# EAGLE design cannon (EAGLE 9.3.2)
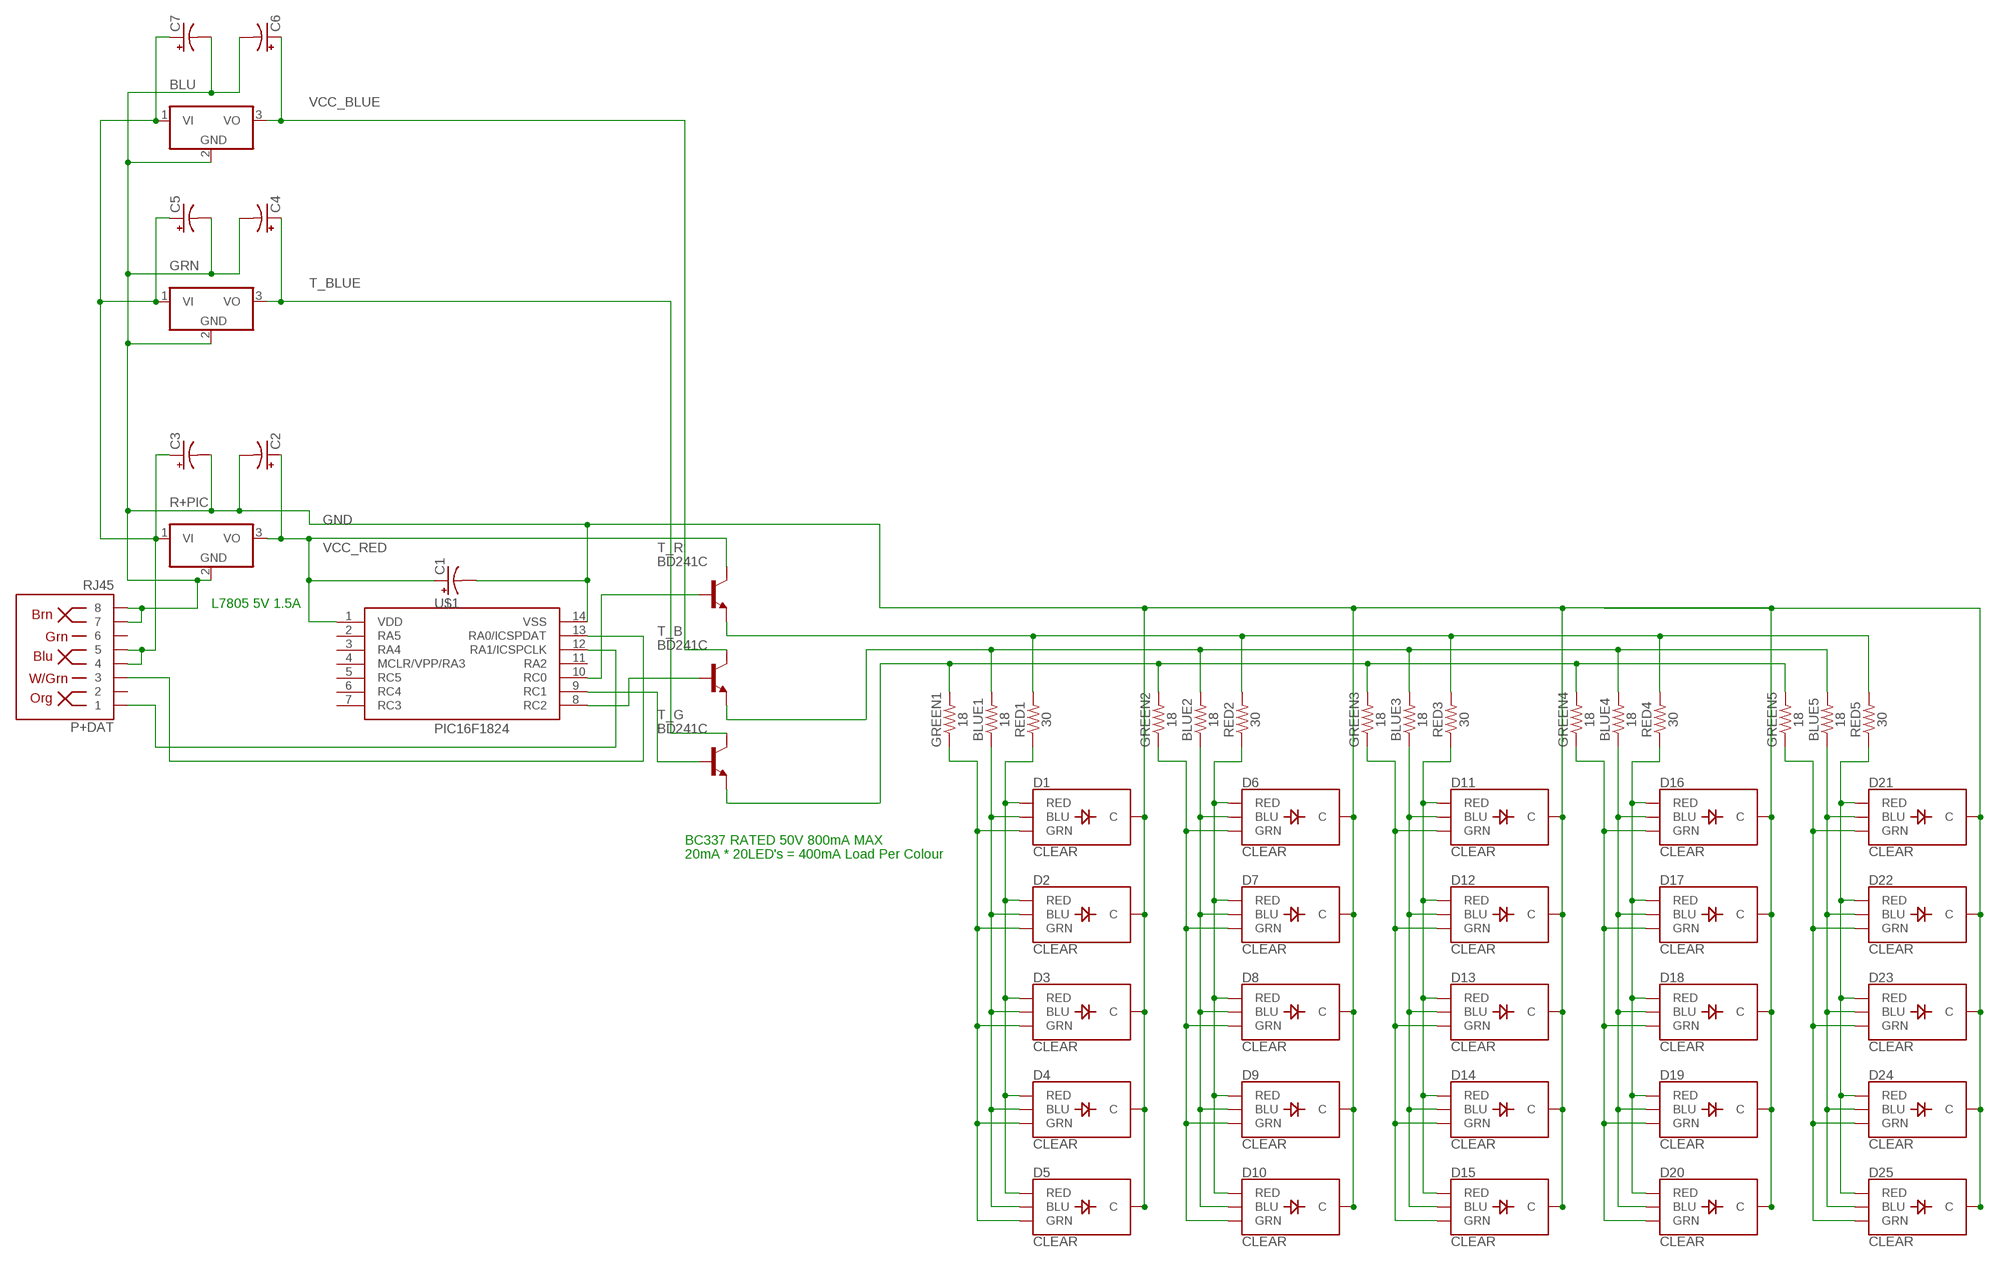
[diagram p0: schematic, sheet 1]

## Parts
BLU  7805TV  [TO220V]
BLUE1  18  10OHM-HORIZ-1/4W-1%  [AXIAL-0.3]
BLUE2  18  10OHM-HORIZ-1/4W-1%  [AXIAL-0.3]
BLUE3  18  10OHM-HORIZ-1/4W-1%  [AXIAL-0.3]
BLUE4  18  10OHM-HORIZ-1/4W-1%  [AXIAL-0.3]
BLUE5  18  10OHM-HORIZ-1/4W-1%  [AXIAL-0.3]
C1  0.1uF  CAPACITOR-PE2.5-6  [E2,5-6]
C2  0.1uF  CAPACITOR-PE2.5-6  [E2,5-6]
C3  0.33uF  CAPACITOR-PE2.5-6  [E2,5-6]
C4  0.1uF  CAPACITOR-PE2.5-6  [E2,5-6]
C5  0.33uF  CAPACITOR-PE2.5-6  [E2,5-6]
C6  0.1uF  CAPACITOR-PE2.5-6  [E2,5-6]
C7  0.33uF  CAPACITOR-PE2.5-6  [E2,5-6]
D1  CLEAR  LED-RGB-CCCLEAR  [LED-RGB-THRU]
D2  CLEAR  LED-RGB-CCCLEAR  [LED-RGB-THRU]
D3  CLEAR  LED-RGB-CCCLEAR  [LED-RGB-THRU]
D4  CLEAR  LED-RGB-CCCLEAR  [LED-RGB-THRU]
D5  CLEAR  LED-RGB-CCCLEAR  [LED-RGB-THRU]
D6  CLEAR  LED-RGB-CCCLEAR  [LED-RGB-THRU]
D7  CLEAR  LED-RGB-CCCLEAR  [LED-RGB-THRU]
D8  CLEAR  LED-RGB-CCCLEAR  [LED-RGB-THRU]
D9  CLEAR  LED-RGB-CCCLEAR  [LED-RGB-THRU]
D10  CLEAR  LED-RGB-CCCLEAR  [LED-RGB-THRU]
D11  CLEAR  LED-RGB-CCCLEAR  [LED-RGB-THRU]
D12  CLEAR  LED-RGB-CCCLEAR  [LED-RGB-THRU]
D13  CLEAR  LED-RGB-CCCLEAR  [LED-RGB-THRU]
D14  CLEAR  LED-RGB-CCCLEAR  [LED-RGB-THRU]
D15  CLEAR  LED-RGB-CCCLEAR  [LED-RGB-THRU]
D16  CLEAR  LED-RGB-CCCLEAR  [LED-RGB-THRU]
D17  CLEAR  LED-RGB-CCCLEAR  [LED-RGB-THRU]
D18  CLEAR  LED-RGB-CCCLEAR  [LED-RGB-THRU]
D19  CLEAR  LED-RGB-CCCLEAR  [LED-RGB-THRU]
D20  CLEAR  LED-RGB-CCCLEAR  [LED-RGB-THRU]
D21  CLEAR  LED-RGB-CCCLEAR  [LED-RGB-THRU]
D22  CLEAR  LED-RGB-CCCLEAR  [LED-RGB-THRU]
D23  CLEAR  LED-RGB-CCCLEAR  [LED-RGB-THRU]
D24  CLEAR  LED-RGB-CCCLEAR  [LED-RGB-THRU]
D25  CLEAR  LED-RGB-CCCLEAR  [LED-RGB-THRU]
GREEN1  18  10OHM-HORIZ-1/4W-1%  [AXIAL-0.3]
GREEN2  18  10OHM-HORIZ-1/4W-1%  [AXIAL-0.3]
GREEN3  18  10OHM-HORIZ-1/4W-1%  [AXIAL-0.3]
GREEN4  18  10OHM-HORIZ-1/4W-1%  [AXIAL-0.3]
GREEN5  18  10OHM-HORIZ-1/4W-1%  [AXIAL-0.3]
GRN  7805TV  [TO220V]
P+DAT  RJ45  RJ45-8  [RJ45-8]
R+PIC  7805TV  [TO220V]
RED1  30  10OHM-HORIZ-1/4W-1%  [AXIAL-0.3]
RED2  30  10OHM-HORIZ-1/4W-1%  [AXIAL-0.3]
RED3  30  10OHM-HORIZ-1/4W-1%  [AXIAL-0.3]
RED4  30  10OHM-HORIZ-1/4W-1%  [AXIAL-0.3]
RED5  30  10OHM-HORIZ-1/4W-1%  [AXIAL-0.3]
T_B  BD241C  2SC1306  [TO220BV]
T_G  BD241C  2SC1306  [TO220BV]
T_R  BD241C  2SC1306  [TO220BV]
U$1  PIC16F1824  [DIP787W45P254L1905H533Q14B]

## Nets
GND: BLU.2(GND) C1.- C2.- C3.- C4.- C5.- C6.- C7.- D1.2(C) D2.2(C) D3.2(C) D4.2(C) D5.2(C) D6.2(C) D7.2(C) D8.2(C) D9.2(C) D10.2(C) D11.2(C) D12.2(C) D13.2(C) D14.2(C) D15.2(C) D16.2(C) D17.2(C) D18.2(C) D19.2(C) D20.2(C) D21.2(C) D22.2(C) D23.2(C) D24.2(C) D25.2(C) GRN.2(GND) P+DAT.7 P+DAT.8 R+PIC.2(GND) U$1.14(VSS)
N$1: P+DAT.1 U$1.12(RA1/ICSPCLK)
N$2: P+DAT.3 U$1.13(RA0/ICSPDAT)
N$4: RED1.P$2 RED2.P$2 RED3.P$2 RED4.P$2 RED5.P$2 T_R.3(E)
N$5: T_R.1(B) U$1.10(RC0)
N$6: T_G.1(B) U$1.9(RC1)
N$7: T_B.1(B) U$1.8(RC2)
N$9: D1.1(RED) D2.1(RED) D3.1(RED) D4.1(RED) D5.1(RED) RED1.P$1
N$10: BLUE2.P$1 D6.4(BLU) D7.4(BLU) D8.4(BLU) D9.4(BLU) D10.4(BLU)
N$11: D6.1(RED) D7.1(RED) D8.1(RED) D9.1(RED) D10.1(RED) RED2.P$1
N$12: D6.3(GRN) D7.3(GRN) D8.3(GRN) D9.3(GRN) D10.3(GRN) GREEN2.P$1
N$13: BLUE1.P$1 D1.4(BLU) D2.4(BLU) D3.4(BLU) D4.4(BLU) D5.4(BLU)
N$14: D1.3(GRN) D2.3(GRN) D3.3(GRN) D4.3(GRN) D5.3(GRN) GREEN1.P$1
N$15: D11.3(GRN) D12.3(GRN) D13.3(GRN) D14.3(GRN) D15.3(GRN) GREEN3.P$1
N$16: BLUE3.P$1 D11.4(BLU) D12.4(BLU) D13.4(BLU) D14.4(BLU) D15.4(BLU)
N$17: BLUE1.P$2 BLUE2.P$2 BLUE3.P$2 BLUE4.P$2 BLUE5.P$2 T_B.3(E)
N$18: D11.1(RED) D12.1(RED) D13.1(RED) D14.1(RED) D15.1(RED) RED3.P$1
N$19: D16.3(GRN) D17.3(GRN) D18.3(GRN) D19.3(GRN) D20.3(GRN) GREEN4.P$1
N$20: BLUE4.P$1 D16.4(BLU) D17.4(BLU) D18.4(BLU) D19.4(BLU) D20.4(BLU)
N$21: D16.1(RED) D17.1(RED) D18.1(RED) D19.1(RED) D20.1(RED) RED4.P$1
N$22: GREEN1.P$2 GREEN2.P$2 GREEN3.P$2 GREEN4.P$2 GREEN5.P$2 T_G.3(E)
N$25: BLU.1(VI) C3.+ C5.+ C7.+ GRN.1(VI) P+DAT.4 P+DAT.5 R+PIC.1(VI)
N$26: D21.3(GRN) D22.3(GRN) D23.3(GRN) D24.3(GRN) D25.3(GRN) GREEN5.P$1
N$27: BLUE5.P$1 D21.4(BLU) D22.4(BLU) D23.4(BLU) D24.4(BLU) D25.4(BLU)
N$28: D21.1(RED) D22.1(RED) D23.1(RED) D24.1(RED) D25.1(RED) RED5.P$1
T_BLUE: C4.+ GRN.3(VO) T_G.2(C)
VCC_BLUE: BLU.3(VO) C6.+ T_B.2(C)
VCC_RED: C1.+ C2.+ R+PIC.3(VO) T_R.2(C) U$1.1(VDD)
Unconnected: P+DAT.2 P+DAT.6 U$1.2(RA5) U$1.3(RA4) U$1.4(MCLR/VPP/RA3) U$1.5(RC5) U$1.6(RC4) U$1.7(RC3) U$1.11(RA2)

## Notes on the sheet
- L7805 5V 1.5A
- BC337 RATED 50V 800mA MAX
- 20mA * 20LED's = 400mA Load Per Colour

## Library data of the parts
BLU GRN R+PIC = linear:78*: Positive VOLTAGE REGULATOR Source: http://cache.national.com/ds/LM/LM78L05.pdf http://www.fairchildsemi.com/ds/LM/LM7805.pdf
BLUE1-BLUE5 GREEN1-GREEN5 RED1-RED5 = SparkFun-Resistors:10OHM: 10Ω resistor A resistor is a passive two-terminal electrical component that implements electrical resistance as a circuit element. Resistors act to reduce current flow, and, at the same time, act to lower voltage levels within circuits. - Wikipedia; PROD_ID: RES-12180; VALUE: 10
C1-C7 = BeagleBone_Blue_R3:CAPACITOR-P: POLARIZED CAPACITOR, American symbol
D1 = SparkFun-LED_MOD:LED-RGB-CC: LED-RGB Common Cathode Packages: LED RGB-THRU LED_PIRANHA_5MM SparkFun Products: RGB Diffused Common Cathode- Diffuse <[https://www.sparkfun.com/products/9264]> RGB Diffused Common Cathode - Clear <[https://www.sparkfun.com/products/105]> LED-RGB 5mm Square (Piranha) <[https://www.sparkfun.com/products/11679]>; PROD_ID: DIO-08418; SPICEPREFIX: E
D2-D25 = SparkFun-LED_MOD:LED-RGB-CC: LED-RGB Common Cathode Packages: LED RGB-THRU LED_PIRANHA_5MM SparkFun Products: RGB Diffused Common Cathode- Diffuse <[https://www.sparkfun.com/products/9264]> RGB Diffused Common Cathode - Clear <[https://www.sparkfun.com/products/105]> LED-RGB 5mm Square (Piranha) <[https://www.sparkfun.com/products/11679]>; PROD_ID: DIO-08418
P+DAT = SparkFun-Connectors:RJ45-8: RJ45 Jack - 8 pin Simple RJ45, 8-pin connection. Commonly used for Cat5, Cat5e, and Cat6 Ethernet cables. Here is the connector we sell at SparkFun: RJ45 8-Pin Connector <https://www.sparkfun.com/products/643> (PRT-00643) Datasheet <https://cdn.sparkfun.com/datasheets/Prototyping/04908.pdf> It is used on this SparkFun product: SparkFun RJ45 Breakout <https://www.sparkfun.com/products/716> (BOB-00716) Note, you may also be interested in the "MAGJACK" version of this. It is basically a RJ45 connector, but also has some status LEDs built into the connector housing. You can check that out in this library at the device named "MAGJACK.dev" and see these products online: RJ45 Ethernet MagJack-Compatible <https://www.sparkfun.com/products/8534> (PRT-08534) SparkFun RJ45 MagJack Breakout <https://www.sparkfun.com/products/13021> (BOB-13021); PROD_ID: CONN-08506; SF_ID: PRT-00643
T_B T_G T_R = transistor:2SC1306: NPN Transistor Final RF Power Outupt Source: 2sc1306.pdf
U$1 = pic:PIC16F1824

## Board
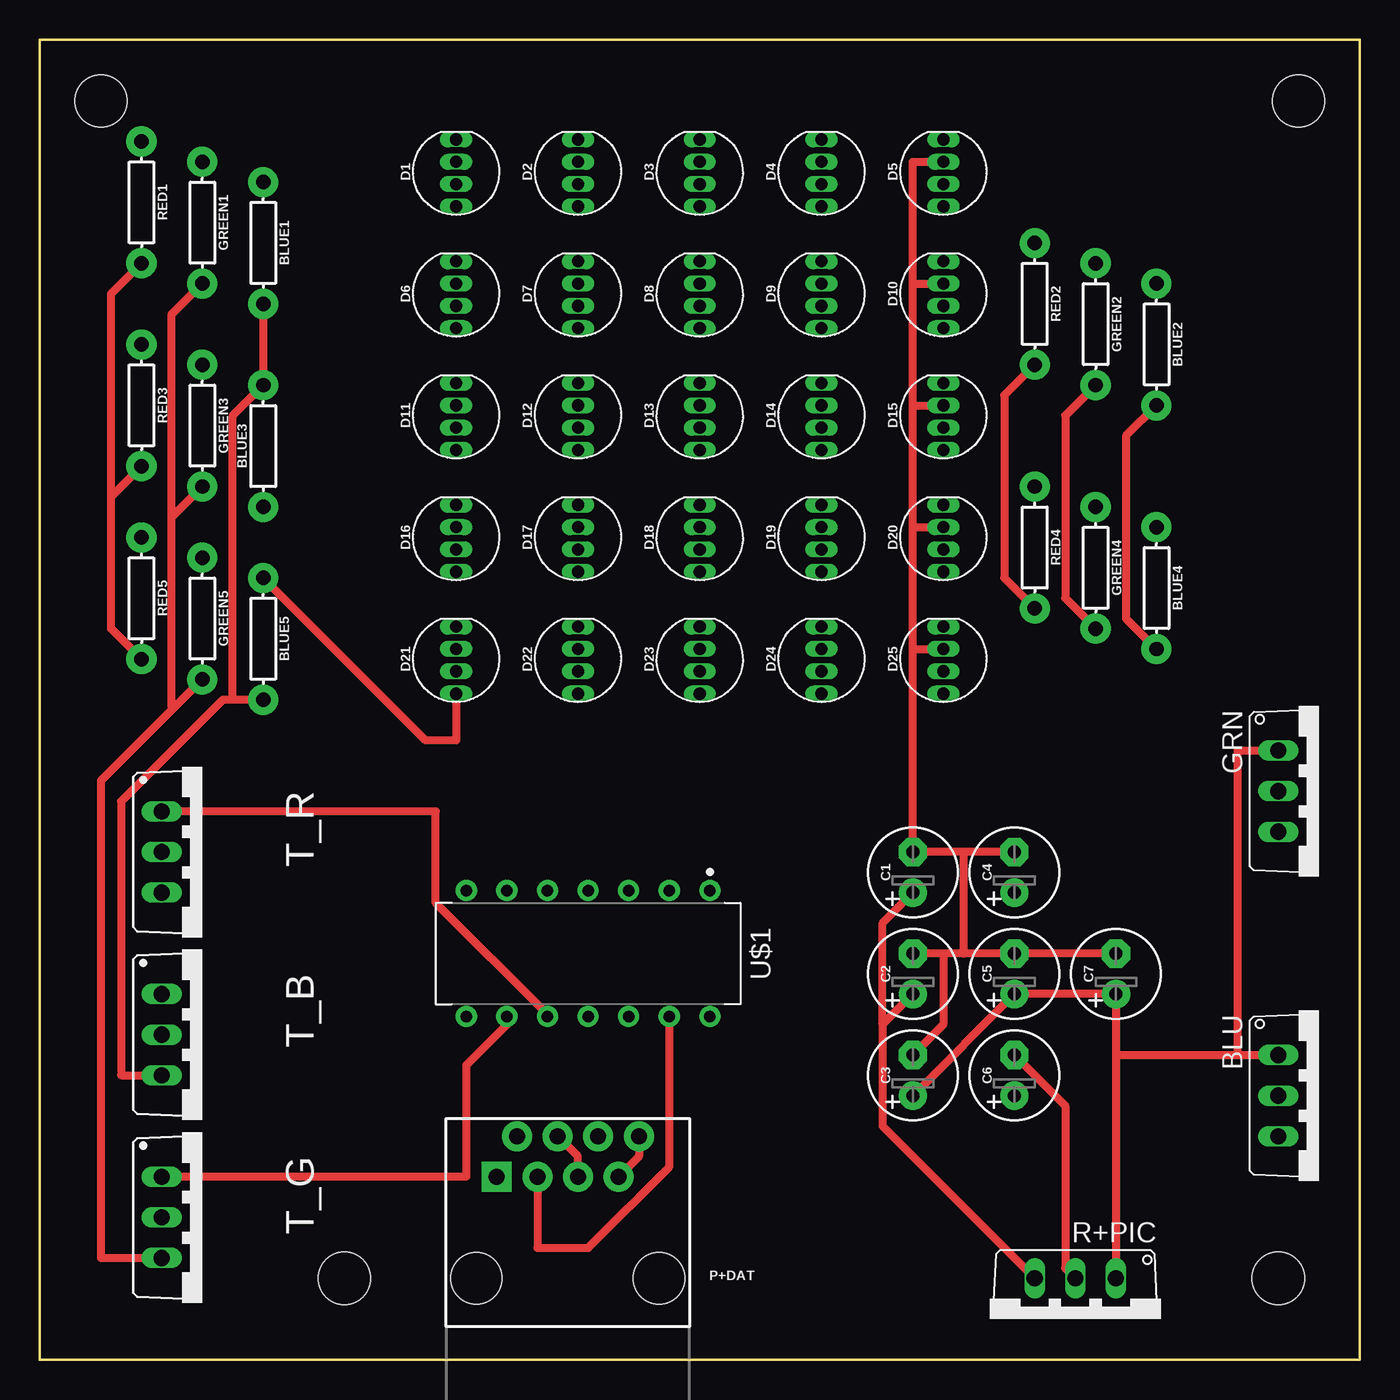
[diagram p1: board, top side]
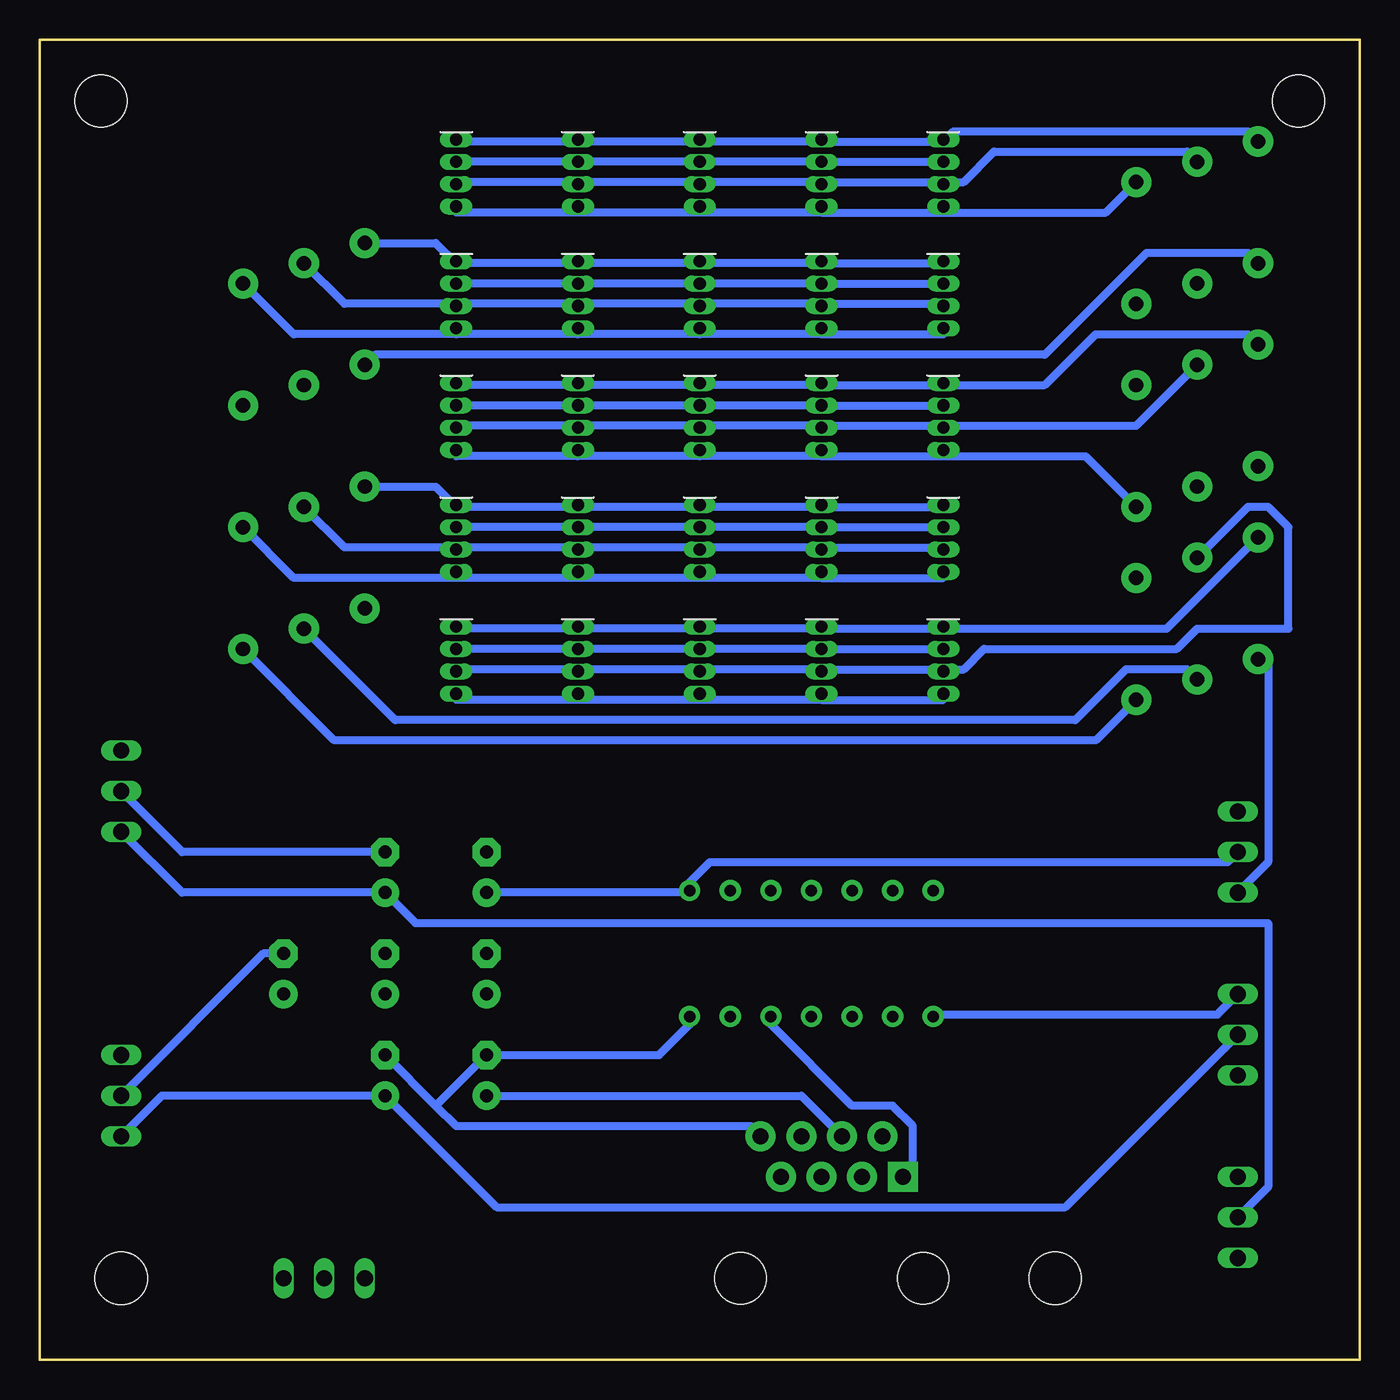
[diagram p2: board, bottom side, seen from below]

Size 82.55 x 82.55 mm. Coordinates in mm from the lower left corner, seen from the top.
Outline: 0,0 0,82.55 82.55,82.55 82.55,0 0,0
Copper layers (1*16): Top 0.035mm / dielectric 1.5mm / Bottom 0.035mm
Design rules "cannon *": minimum track width 0.5mm, minimum drill 0.5mm, track to track 0.5mm, track to pad 0.5mm, pad to pad 0.25mm, via to via 0.5mm, smd to smd 6mil, copper to edge 40mil, drill to drill 6mil, minimum pad ring 1mil, minimum via ring 8mil, stop-mask expansion 4mil, vias tented up to drill 0mil, thermal gap 10mil
Holes 3.26 mm at 77.47,5.08 19.05,5.08 3.81,78.74 78.74,78.74

### Footprints (pad centres in the part's own frame; a part is rotated, then mirrored left to right if it is on the bottom)
TO220V = drill 1.016 long: 1 -2.54,-2.54; 2 0,-2.54; 3 2.54,-2.54
AXIAL-0.3 = drill 0.9 pad 1.88: P$1 -3.81,0; P$2 3.81,0
E2,5-6 = drill 0.813 pad 1.778: + -1.27,0 | drill 0.813 pad 1.778 octagon: - 1.27,0
LED-RGB-THRU = drill 0.762 pad 0.889 long: 1 2.032,0; 2 0.635,0; 3 -0.762,0; 4 -2.159,0
RJ45-8 = drill 1 pad 1.88 square: 1 -4.445,6.35 | drill 1 pad 1.88: 2 -3.175,8.89; 3 -1.905,6.35; 4 -0.635,8.89; 5 0.635,6.35; 6 1.905,8.89; 7 3.175,6.35; 8 4.445,8.89 | hole 3.2: -5.715,0; 5.715,0
TO220BV = drill 1.016 long: 1 -2.54,-2.54; 2 0,-2.54; 3 2.54,-2.54
DIP787W45P254L1905H533Q14B = drill 0.723 pad 1.323: 1 -3.937,7.62; 2 -3.937,5.08; 3 -3.937,2.54; 4 -3.937,0; 5 -3.937,-2.54; 6 -3.937,-5.08; 7 -3.937,-7.62; 8 3.937,-7.62; 9 3.937,-5.08; 10 3.937,-2.54; 11 3.937,0; 12 3.937,2.54; 13 3.937,5.08; 14 3.937,7.62

### Placement (x,y rotation side)
BLU  80.01,16.51 270 top
BLUE1  13.97,69.85 270 top
BLUE2  69.85,63.5 270 top
BLUE3  13.97,57.15 90 top
BLUE4  69.85,48.26 270 top
BLUE5  13.97,45.09 270 top
C1  54.61,30.48 90 top
C2  54.61,24.13 90 top
C3  54.61,17.78 90 top
C4  60.96,30.48 90 top
C5  60.96,24.13 90 top
C6  60.96,17.78 90 top
C7  67.31,24.13 90 top
D1  26.04,74.3 90 top
D2  33.66,74.3 90 top
D3  41.27,74.3 90 top
D4  48.9,74.3 90 top
D5  56.52,74.3 90 top
D6  26.04,66.67 90 top
D7  33.66,66.67 90 top
D8  41.27,66.67 90 top
D9  48.9,66.67 90 top
D10  56.52,66.67 90 top
D11  26.04,59.05 90 top
D12  33.66,59.05 90 top
D13  41.27,59.05 90 top
D14  48.9,59.05 90 top
D15  56.52,59.05 90 top
D16  26.04,51.44 90 top
D17  33.66,51.44 90 top
D18  41.27,51.44 90 top
D19  48.9,51.44 90 top
D20  56.52,51.44 90 top
D21  26.04,43.81 90 top
D22  33.66,43.81 90 top
D23  41.27,43.81 90 top
D24  48.9,43.81 90 top
D25  56.52,43.81 90 top
GREEN1  10.16,71.12 270 top
GREEN2  66.04,64.77 270 top
GREEN3  10.16,58.42 270 top
GREEN4  66.04,49.53 270 top
GREEN5  10.16,46.35 270 top
GRN  80.01,35.56 270 top
P+DAT  33.02,5.08 0 top
R+PIC  64.77,2.54 180 top
RED1  6.35,72.39 270 top
RED2  62.23,66.04 270 top
RED3  6.35,59.69 270 top
RED4  62.23,50.8 270 top
RED5  6.35,47.62 270 top
T_B  10.16,20.32 270 top
T_G  10.16,8.89 270 top
T_R  10.16,31.75 270 top
U$1  34.29,25.4 270 top

### Tracks (layer width: path | path; a pad name or v marks a point on that pad's centre or on a via)
GND
  Top 0.5: P+DAT.7 37.47,12.7 P+DAT.8 | R+PIC.2 64.14,5.71 64.14,15.88 C6.- | C4.- 57.78,31.75 | 57.78,31.75 C1.- 54.61,44.45 | 57.78,25.4 C5.- C7.- | 57.78,25.4 56.52,25.4 | 56.52,25.4 C2.- | 57.78,25.4 57.78,31.75 | 54.61,44.45 D25.2 | 54.61,52.07 D20.2 | 54.61,44.45 54.61,52.07 | 54.61,59.69 D15.2 | 54.61,52.07 54.61,59.69 | 54.61,67.31 D10.2 | 54.61,59.69 54.61,67.31 | D5.2 54.61,74.93 54.61,67.31 | C3.- 56.52,20.95 56.52,25.4
  Bottom 0.5: U$1.14 41.91,20.95 43.81,19.05 C3.- 57.78,15.88 | P+DAT.8 38.1,14.61 56.52,14.61 57.78,15.88 | C6.- 57.78,15.88 | D1.2 D2.2 D3.2 D4.2 D5.2 | D6.2 D7.2 D8.2 D9.2 D10.2 | D11.2 D12.2 D13.2 D14.2 D15.2 | D16.2 D17.2 D18.2 D19.2 D20.2 | D21.2 D22.2 D23.2 D24.2 D25.2 | GRN.2 73.66,31.75 C4.- | BLU.2 68.58,25.4 C7.-
N$1
  Bottom 0.5: P+DAT.1 27.94,11.43 27.94,14.61 29.21,15.88 31.75,15.88 36.83,20.95 U$1.12
N$2
  Top 0.5: U$1.13 39.37,12.06 34.29,6.99 31.11,6.99 P+DAT.3
N$4
  Top 0.5: RED4.P$2 60.33,48.9 60.33,60.33 RED2.P$2 | 4.45,53.98 RED3.P$2 | 4.45,53.98 4.45,45.72 RED5.P$2 | RED1.P$2 4.45,66.67 4.45,53.98
  Bottom 0.5: T_R.3 5.71,31.11 5.71,43.81 RED5.P$2 | RED2.P$2 61.59,62.87 19.68,62.87 13.34,69.22 6.99,69.22 RED1.P$2
N$5
  Top 0.5: T_R.1 24.77,34.29 24.77,28.57 31.75,21.59 U$1.10
N$6
  Top 0.5: T_G.1 26.67,11.43 26.67,18.41 29.21,20.95 U$1.9
N$7
  Bottom 0.5: T_B.1 8.89,21.59 26.67,21.59 U$1.8
N$9
  Bottom 0.5: 33.66,76.2 26.04,76.2 | 33.66,76.2 41.27,76.2 | 33.66,76.2 D2.1 | 41.27,76.2 48.9,76.2 | 41.27,76.2 D3.1 | 48.9,76.2 56.52,76.2 D5.1 | 48.9,76.2 D4.1 | RED1.P$1 6.99,76.83 25.4,76.83 26.04,76.2 | 26.04,76.2 D1.1
N$10
  Bottom 0.5: 33.66,64.14 26.04,64.14 D6.4 | 33.66,64.14 41.27,64.14 | 33.66,64.14 D7.4 | 41.27,64.14 48.9,64.14 | 41.27,64.14 D8.4 | 48.9,64.14 56.52,64.14 | 48.9,64.14 D9.4 | BLUE2.P$1 66.67,64.14 56.52,64.14 | 56.52,64.14 D10.4
N$11
  Bottom 0.5: 56.52,68.58 57.78,69.85 RED2.P$1 | 33.66,68.58 26.04,68.58 D6.1 | 33.66,68.58 41.27,68.58 | 33.66,68.58 D7.1 | 41.27,68.58 48.9,68.58 | 41.27,68.58 D8.1 | 48.9,68.58 56.52,68.58 | 56.52,68.58 D10.1 | 48.9,68.58 D9.1
N$12
  Bottom 0.5: 33.66,66.04 26.04,66.04 D6.3 | 33.66,66.04 41.27,66.04 | 33.66,66.04 D7.3 | 41.27,66.04 48.9,66.04 | 41.27,66.04 D8.3 | 48.9,66.04 56.52,66.04 | 48.9,66.04 D9.3 | GREEN2.P$1 63.5,66.04 56.52,66.04 | 56.52,66.04 D10.3
N$13
  Bottom 0.5: 33.66,71.75 26.04,71.75 | 33.66,71.75 41.27,71.75 | 33.66,71.75 D2.4 | 41.27,71.75 48.9,71.75 | 41.27,71.75 D3.4 | 48.9,71.75 56.52,71.75 D5.4 | 48.9,71.75 D4.4 | BLUE1.P$1 15.88,71.75 26.04,71.75 | 26.04,71.75 D1.4
N$14
  Bottom 0.5: 33.66,73.66 26.04,73.66 | 33.66,73.66 41.27,73.66 | 33.66,73.66 D2.3 | 41.27,73.66 48.9,73.66 | 41.27,73.66 D3.3 | 48.9,73.66 56.52,73.66 D5.3 | 48.9,73.66 D4.3 | GREEN1.P$1 10.79,75.56 22.86,75.56 24.77,73.66 26.04,73.66 | 26.04,73.66 D1.3
N$15
  Bottom 0.5: 33.66,58.42 26.04,58.42 | 33.66,58.42 41.27,58.42 | 33.66,58.42 D12.3 | 41.27,58.42 48.9,58.42 | 41.27,58.42 D13.3 | 48.9,58.42 56.52,58.42 D15.3 | 48.9,58.42 D14.3 | GREEN3.P$1 13.97,58.42 26.04,58.42 | 26.04,58.42 D11.3
N$16
  Bottom 0.5: 33.66,56.52 26.04,56.52 | 33.66,56.52 41.27,56.52 | 33.66,56.52 D12.4 | 41.27,56.52 48.9,56.52 | 41.27,56.52 D13.4 | 48.9,56.52 56.52,56.52 D15.4 | 48.9,56.52 D14.4 | BLUE3.P$1 17.14,56.52 26.04,56.52 | 26.04,56.52 D11.4
N$17
  Top 0.5: BLUE4.P$2 67.94,46.35 67.94,57.78 BLUE2.P$2 | BLUE1.P$2 BLUE3.P$2 12.06,59.05 12.06,41.27 | T_B.3 5.08,17.78 5.08,34.92 11.43,41.27 12.06,41.27 | BLUE5.P$2 12.06,41.27
  Bottom 0.5: BLUE4.P$2 64.14,38.73 16.51,38.73 BLUE5.P$2
N$18
  Bottom 0.5: 33.66,60.96 26.04,60.96 | 33.66,60.96 41.27,60.96 | 33.66,60.96 D12.1 | 41.27,60.96 48.9,60.96 | 41.27,60.96 D13.1 | 48.9,60.96 56.52,60.96 D15.1 | 48.9,60.96 D14.1 | RED3.P$1 6.99,64.14 16.51,64.14 19.68,60.96 26.04,60.96 | 26.04,60.96 D11.1
N$19
  Bottom 0.5: 33.66,50.8 26.04,50.8 D16.3 | 33.66,50.8 41.27,50.8 | 33.66,50.8 D17.3 | 41.27,50.8 48.9,50.8 | 41.27,50.8 D18.3 | 48.9,50.8 56.52,50.8 | 48.9,50.8 D19.3 | GREEN4.P$1 63.5,50.8 56.52,50.8 | 56.52,50.8 D20.3
N$20
  Bottom 0.5: 33.66,48.9 26.04,48.9 D16.4 | 33.66,48.9 41.27,48.9 | 33.66,48.9 D17.4 | 41.27,48.9 48.9,48.9 | 41.27,48.9 D18.4 | 48.9,48.9 56.52,48.9 | 48.9,48.9 D19.4 | BLUE4.P$1 66.67,48.9 56.52,48.9 | 56.52,48.9 D20.4
N$21
  Bottom 0.5: 56.52,53.34 57.78,54.61 RED4.P$1 | 33.66,53.34 26.04,53.34 D16.1 | 33.66,53.34 41.27,53.34 | 33.66,53.34 D17.1 | 41.27,53.34 48.9,53.34 | 41.27,53.34 D18.1 | 48.9,53.34 56.52,53.34 | 56.52,53.34 D20.1 | 48.9,53.34 D19.1
N$22
  Top 0.5: GREEN4.P$2 64.14,47.62 64.14,59.05 GREEN2.P$2 | T_G.3 3.81,6.35 3.81,36.2 8.26,40.64 | GREEN5.P$2 8.26,40.64 | 8.26,52.7 GREEN3.P$2 | 8.26,40.64 8.26,52.7 | GREEN1.P$2 8.26,65.41 8.26,52.7
  Bottom 0.5: GREEN4.P$2 60.33,40.01 17.78,40.01 14.61,43.18 10.79,43.18 GREEN5.P$2
N$25
  Top 0.5: P+DAT.4 33.66,12.7 P+DAT.5 | C3.+ C5.+ C7.+ 67.31,19.05 | 67.31,19.05 R+PIC.1 | 67.31,19.05 74.93,19.05 | 74.93,19.05 BLU.1 | GRN.1 74.93,38.1 74.93,19.05
  Bottom 0.5: P+DAT.4 34.92,16.51 C3.+
N$26
  Bottom 0.5: 33.66,43.18 26.04,43.18 | 33.66,43.18 41.27,43.18 | 33.66,43.18 D22.3 | 41.27,43.18 48.9,43.18 | 41.27,43.18 D23.3 | 48.9,43.18 56.52,43.18 D25.3 | 48.9,43.18 D24.3 | GREEN5.P$1 6.99,53.34 5.71,53.34 4.45,52.07 4.45,45.72 10.16,45.72 11.43,44.45 23.5,44.45 24.77,43.18 26.04,43.18 | 26.04,43.18 D21.3
N$27
  Top 0.5: BLUE5.P$1 24.13,38.73 26.04,38.73 D21.4
  Bottom 0.5: 33.66,41.27 26.04,41.27 D21.4 | 33.66,41.27 41.27,41.27 | 33.66,41.27 D22.4 | 41.27,41.27 48.9,41.27 | 41.27,41.27 D23.4 | 48.9,41.27 56.52,41.27 D25.4 | 48.9,41.27 D24.4
N$28
  Bottom 0.5: 33.66,45.72 26.04,45.72 | 33.66,45.72 41.27,45.72 | 33.66,45.72 D22.1 | 41.27,45.72 48.9,45.72 | 41.27,45.72 D23.1 | 48.9,45.72 56.52,45.72 D25.1 | 48.9,45.72 D24.1 | RED5.P$1 12.06,45.72 26.04,45.72 | 26.04,45.72 D21.1
T_BLUE
  Bottom 0.5: T_G.2 5.71,10.79 5.71,27.3 59.05,27.3 C4.+ 73.66,29.21 GRN.3
VCC_BLUE
  Bottom 0.5: T_B.2 18.41,9.53 53.98,9.53 C6.+ 74.93,16.51 BLU.3
VCC_RED
  Top 0.5: R+PIC.3 52.7,14.61 52.7,20.95 | C2.+ 52.7,20.95 | C1.+ 52.7,27.3 52.7,20.95
  Bottom 0.5: T_R.2 8.26,31.11 40.64,31.11 41.91,29.84 U$1.1 41.91,29.21 C1.+